# EAGLE schematic Pointcast_upper_board_V1.03 (EAGLE 7.4.0)
DESIGNER: Rob Oudendijk; VERSION: V1.03
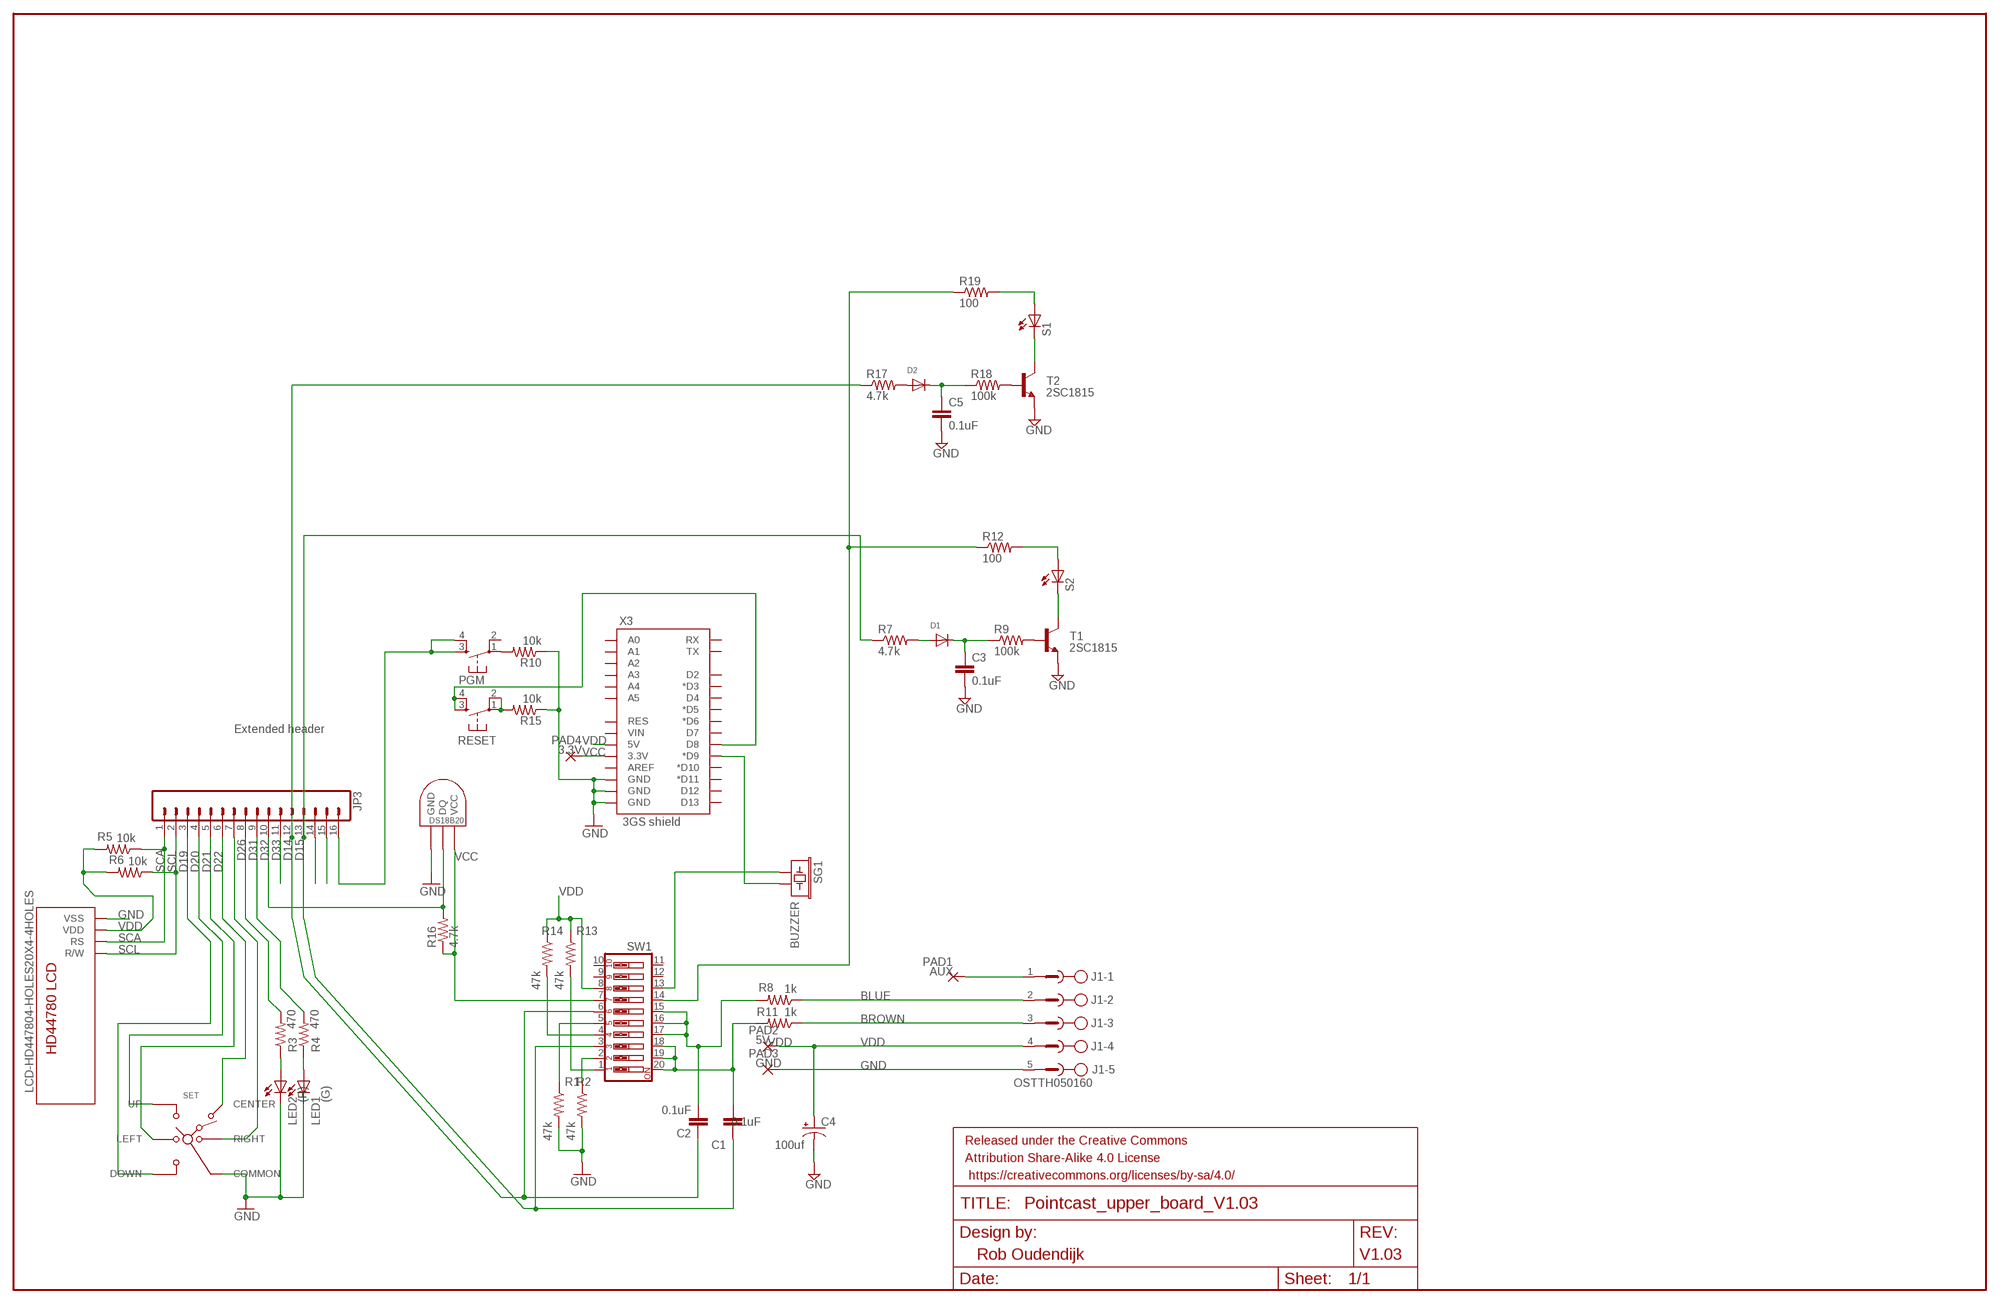
[diagram p0: schematic, sheet 1]

## Parts
C1  0.1uF  C-EU025-024X044  [C025-024X044]
C2  0.1uF  C-EU025-024X044  [C025-024X044]
C3  0.1uF  C-EU025-024X044  [C025-024X044]
C4  100uf  CAP_POLPTH1  [CPOL-RADIAL-100UF-25V]
C5  0.1uF  C-EU025-024X044  [C025-024X044]
D1  DIODEDIODE_BIG  [DO41-10]
D2  DIODEDIODE_BIG  [DO41-10]
FRAME1  FRAME-LEDGER  [CREATIVE_COMMONS]
J1  OSTTH050160  [EDSTL130-05]
JP3  Extended header  M16PTH  [1X16]
LED1  (G)  LED3MM  [LED3MM]
LED2  (R)  LED3MM  [LED3MM]
PAD1  AUX  2,15/1,0  [2,15/1,0]
PAD2  5V  2,15/1,0  [2,15/1,0]
PAD3  GND  2,15/1,0  [2,15/1,0]
PAD4  3.3V  2,15/1,0  [2,15/1,0]
PGM  DTS-6  [DTS-6]
R1  47k  R-US_0207/10  [0207/10]
R2  47k  R-US_0207/10  [0207/10]
R3  470  R-US_0207/10  [0207/10]
R4  470  R-US_0207/10  [0207/10]
R5  10k  R-US_0207/10  [0207/10]
R6  10k  R-US_0207/10  [0207/10]
R7  4.7k  R-US_0207/10  [0207/10]
R8  1k  R-US_0207/10  [0207/10]
R9  100k  R-US_0207/10  [0207/10]
R10  10k  R-US_0207/10  [0207/10]
R11  1k  R-US_0207/10  [0207/10]
R12  100  R-US_0207/10  [0207/10]
R13  47k  R-US_0207/10  [0207/10]
R14  47k  R-US_0207/10  [0207/10]
R15  10k  R-US_0207/10  [0207/10]
R16  4.7k  R-US_0207/10  [0207/10]
R17  4.7k  R-US_0207/10  [0207/10]
R18  100k  R-US_0207/10  [0207/10]
R19  100  R-US_0207/10  [0207/10]
RESET  DTS-6  [DTS-6]
S1  LED3MM  [LED3MM]
S2  LED3MM  [LED3MM]
SET  SKQUCAA010  [SKQU]
SG1  BUZZER  BUZZERPTH  [BUZZER-12MM]
SW1  SW_DIP-10  [EDG-10]
T1  2SC1815  [TO92-ECB]
T2  2SC1815  [TO92-ECB]
TEMP  AVA_DS1820TO92  [AVA_DS1820]
X1  LCD-HD447804-HOLES20X4-4HOLES  [LCD-20X4-4HOLES]
X3  3GS shield  ARDUINO_SHIELDLABEL  [DUEMILANOVE_SHIELD]

## Nets
BLUE: J1.2 R8.1
BROWN: J1.3 R11.1
D14: C2.1 JP3.12 R17.1 SW1.6
D15: C1.1 JP3.13 R7.1 SW1.3
D19: JP3.3 SET.DOWN
D20: JP3.4 SET.UP
D21: JP3.5 SET.LEFT
D22: JP3.6 SET.CENTER
D26: JP3.8 R3.2
D31: JP3.9 R4.2
D32: JP3.10 R16.2 TEMP.DQ
D33: JP3.11
GND [PWP]: C3.2 C4.1(-) C5.2 J1.5 LED1.K(C) LED2.K(C) PAD3.1(P) R1.2 R2.2 R10.1 R15.1 SET.COMMON T1.E T2.E TEMP.GND X1.P$13(VSS) X3.GND@0(GND) X3.GND@1(GND) X3.GND@2(GND)
N$1: SG1.+ SW1.13
N$2: JP3.14
N$3: LED2.A R3.1
N$4: JP3.15
N$6: R14.2 SW1.4
N$7: R12.1 R19.1 SW1.14
N$8: R2.1 SW1.2
N$9: R1.1 SW1.5
N$10: J1.1 PAD1.1(P)
N$23: SG1.- X3.D9(*D9)
N$24: PGM.1 R10.2
N$39: C1.2 R11.2 SW1.18 SW1.19 SW1.20
N$43: R13.2 SW1.1
N$54: D1.A R7.2
N$58: C3.1 D1.C R9.1
N$62: LED1.A R4.1
N$76: R9.2 T1.B
N$77: S2.K(C) T1.C
N$84: R15.2 RESET.1 RESET.2
N$85: RESET.3 RESET.4 X3.D8
N$92: R12.2 S2.A
N$136: D2.A R17.2
N$137: C5.1 D2.C R18.1
N$138: R18.2 T2.B
N$139: S1.K(C) T2.C
N$140: R19.2 S1.A
N$223: C2.2 R8.2 SW1.15 SW1.16 SW1.17
N$244: JP3.16 PGM.3 PGM.4
S$5: JP3.7 SET.RIGHT
SCA: JP3.1 R5.1 X1.P$15(RS)
SCL: JP3.2 R6.1 X1.P$16(R/W)
VCC [PWP]: PAD4.1(P) R16.1 SW1.7 TEMP.VDD(VCC) X3.3.3V
VDD [PWP]: C4.2(+) J1.4 PAD2.1(P) R5.2 R6.2 R13.1 R14.1 SW1.8 X1.P$14(VDD) X3.5V
Unconnected: PGM.2 SW1.9 SW1.10 SW1.11 SW1.12 X3.A0 X3.A1 X3.A2 X3.A3 X3.A4 X3.A5 X3.AREF X3.D2 X3.D3(*D3) X3.D4 X3.D5(*D5) X3.D6(*D6) X3.D7 X3.D10(*D10) X3.D11(*D11) X3.D12 X3.D13 X3.RES X3.RX X3.TX X3.VIN

## Library data of the parts
C1-C3 C5 = rcl:C-EU: CAPACITOR, European symbol
C4 = SparkFun-Capacitors:CAP_POL: Capacitor Polarized These are standard SMD and PTH capacitors. Normally 10uF, 47uF, and 100uF in electrolytic and tantalum varieties. Always verify the external diameter of the through hole cap, it varies with capacity, voltage, and manufacturer. The EIA devices should be standard.
D1 D2 = adafruit:DIODE: Diode SMADIODE - SMA Surface Mount Package 20V 1A Schottky Diode Digikey: 641-1014-6-ND DO-1N4148 - Through Hole Small Current Diode SOD-123 20V 1 A (.5mV Vf) Schottky Diode - Digikey: MBRX120TPMSCT-ND SOD-323 10V 570mA (.38mV Vf, 3ns) Schottky Diode - Digikey: ZLLS410CT-ND SOD-523 30V 30mA Schottky Diode (RB751S-40TE61) - Digikey: RB751S-40TE61CT-ND SOT23-R/W - SOT23 Package (R = Solder Paste/Reflow Ovens, W = Hand-Soldering) BAT54Film 40V 300mA - Digikey: 497-7162-1-ND
FRAME1 = SparkFun-Aesthetics:FRAME-LEDGER: Schematic Frame Standard 11x14 US Ledger frame
J1 = con-ost:OSTTH050160: 5mm Terminal Header
JP3 = SparkFun-Connectors:M16: 1x16 .1" header
LED1 LED2 S1 S2 = adafruit:LED: LED OSRAM: - CHIPLED LG R971, LG N971, LY N971, LG Q971, LY Q971, LO R971, LY R971 LH N974, LH R974 LS Q976, LO Q976, LY Q976 LO Q996 - Hyper CHIPLED LW Q18S LB Q993, LB Q99A, LB R99A - SideLED LS A670, LO A670, LY A670, LG A670, LP A670 LB A673, LV A673, LT A673, LW A673 LH A674 LY A675 LS A676, LA A676, LO A676, LY A676, LW A676 LS A679, LY A679, LG A679 - Hyper Micro SIDELED® LS Y876, LA Y876, LO Y876, LY Y876 LT Y87S - SmartLED LW L88C, LW L88S LB L89C, LB L89S, LG L890 LS L89K, LO L89K, LY L89K LS L896, LA L896, LO L896, LY L896 - TOPLED LS T670, LO T670, LY T670, LG T670, LP T670 LSG T670, LSP T670, LSY T670, LOP T670, LYG T670 LG T671, LOG T671, LSG T671 LB T673, LV T673, LT T673, LW T673 LH T674 LS T676, LA T676, LO T676, LY T676, LB T676, LH T676, LSB T676, LW T676 LB T67C, LV T67C, LT T67C, LS T67K, LO T67K, LY T67K, LW E67C LS E67B, LA E67B, LO E67B, LY E67B, LB E67C, LV E67C, LT E67C LW T67C LS T679, LY T679, LG T679 LS T770, LO T770, LY T770, LG T770, LP T770 LB T773, LV T773, LT T773, LW T773 LH T774 LS E675, LA E675, LY E675, LS T675 LS T776, LA T776, LO T776, LY T776, LB T776 LHGB T686 LT T68C, LB T68C - Hyper Mini TOPLED® LB M676 - Mini TOPLED Santana® LG M470 LS M47K, LO M47K, LY M47K Source: http://www.osram.convergy.de/
PAD1-PAD4 = wirepad:2,15/1,0: THROUGH-HOLE PAD
PGM RESET = switch-tact:DTS-6
R1-R4 R8 R10 R11 R13-R16 = resistor:R-US_: RESISTOR, American symbol
R5 R6 = adafruit:R-US_: RESISTOR, American symbol
R7 R9 R12 R17-R19 = rcl:R-US_: RESISTOR, American symbol
SET = joy_switch:SKQU: Multi Control Devices TACT Switch - 4-directional with Center Push Type. SKQU Series.; MF: ALPS; OC_ADAFRUIT: 504; OC_MOUSER: 688-SKQUCA; OC_NEWARK: 59M1983
SG1 = SparkFun:BUZZER: Buzzer 12mm Spark Fun Electronics SKU : Comp-Buzzer
SW1 = special:SW_DIP-10: DIP SWITCH
T1 T2 = transistor:2SC1815: NPN EPITAXIAL TRANSISTOR Source: TOSHIBA .. 2SC1815 1.pdf
TEMP = nGeigie_upper_boardTeensy 3Gshield upper board V0.98:AVA_DS1820: DS18B20 Programmable Resolution 1-Wire Digital Thermometer Description The DS18B20 digital thermometer provides 9-bit to 12-bit Celsius temperature measurements and has an alarm function with nonvolatile user-programmable upper and lower trigger points. The DS18B20 communicates over a 1-Wire® bus that by definition requires only one data line (and ground) for communication with a central microprocessor. It has an operating temperature range of -55°C to +125°C and is accurate to ±0.5°C over the range of -10°C to +85°C. In addition, the DS18B20 can derive power directly from the data line ("parasite power"), eliminating the need for an external power supply. Each DS18B20 has a unique 64-bit serial code, which allows multiple DS18B20s to function on the same 1-Wire bus. Thus, it is simple to use one microprocessor to control many DS18B20s distributed over a large area. Applications that can benefit from this feature include HVAC environmental controls, temperature monitoring systems inside buildings, equipment, or machinery, and process monitoring and control systems.
X1 = LCD204_I2C:LCD-HD44780
X3 = SparkFun-Boards:ARDUINO_SHIELD: Arduino shield footprint

## Net classes
0 default: width 0.406 mm, drill 0.254 mm, clearance 0.305 mm
1 PWP: width 0.813 mm, drill 0.254 mm, clearance 0.305 mm